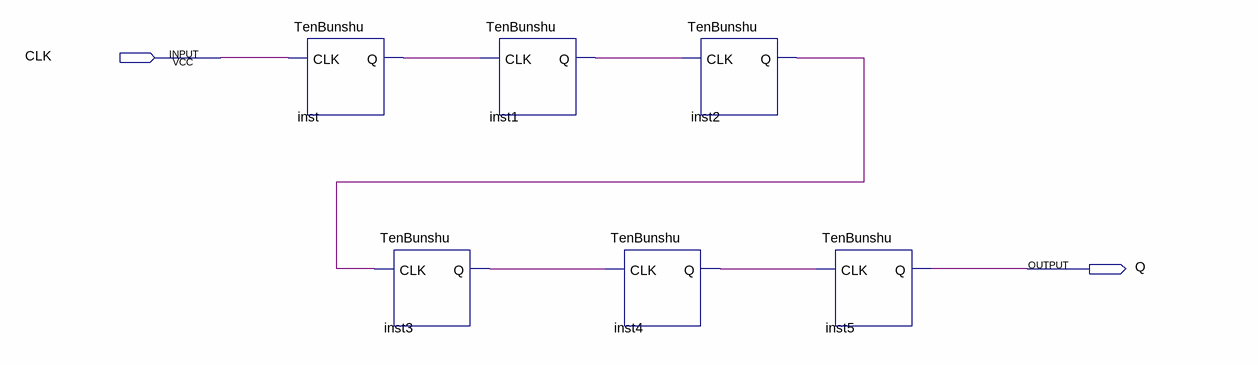
[diagram p0: schematic sheet]
// Quartus schematic Bunshu_50Hz.bdf as structural Verilog: 6 symbols, 2 pins
module Bunshu_50Hz (
  input  CLK,
  output Q
);

  wire inst1_q, inst2_q, inst3_q, inst4_q, inst_q;

  TenBunshu inst (.CLK(CLK), .Q(inst_q));
  TenBunshu inst3 (.CLK(inst2_q), .Q(inst3_q));
  TenBunshu inst1 (.CLK(inst_q), .Q(inst1_q));
  TenBunshu inst4 (.CLK(inst3_q), .Q(inst4_q));
  TenBunshu inst2 (.CLK(inst1_q), .Q(inst2_q));
  TenBunshu inst5 (.CLK(inst4_q), .Q(Q));
endmodule
